# Altium project ece315.PrjPcb (part 1 of 2)
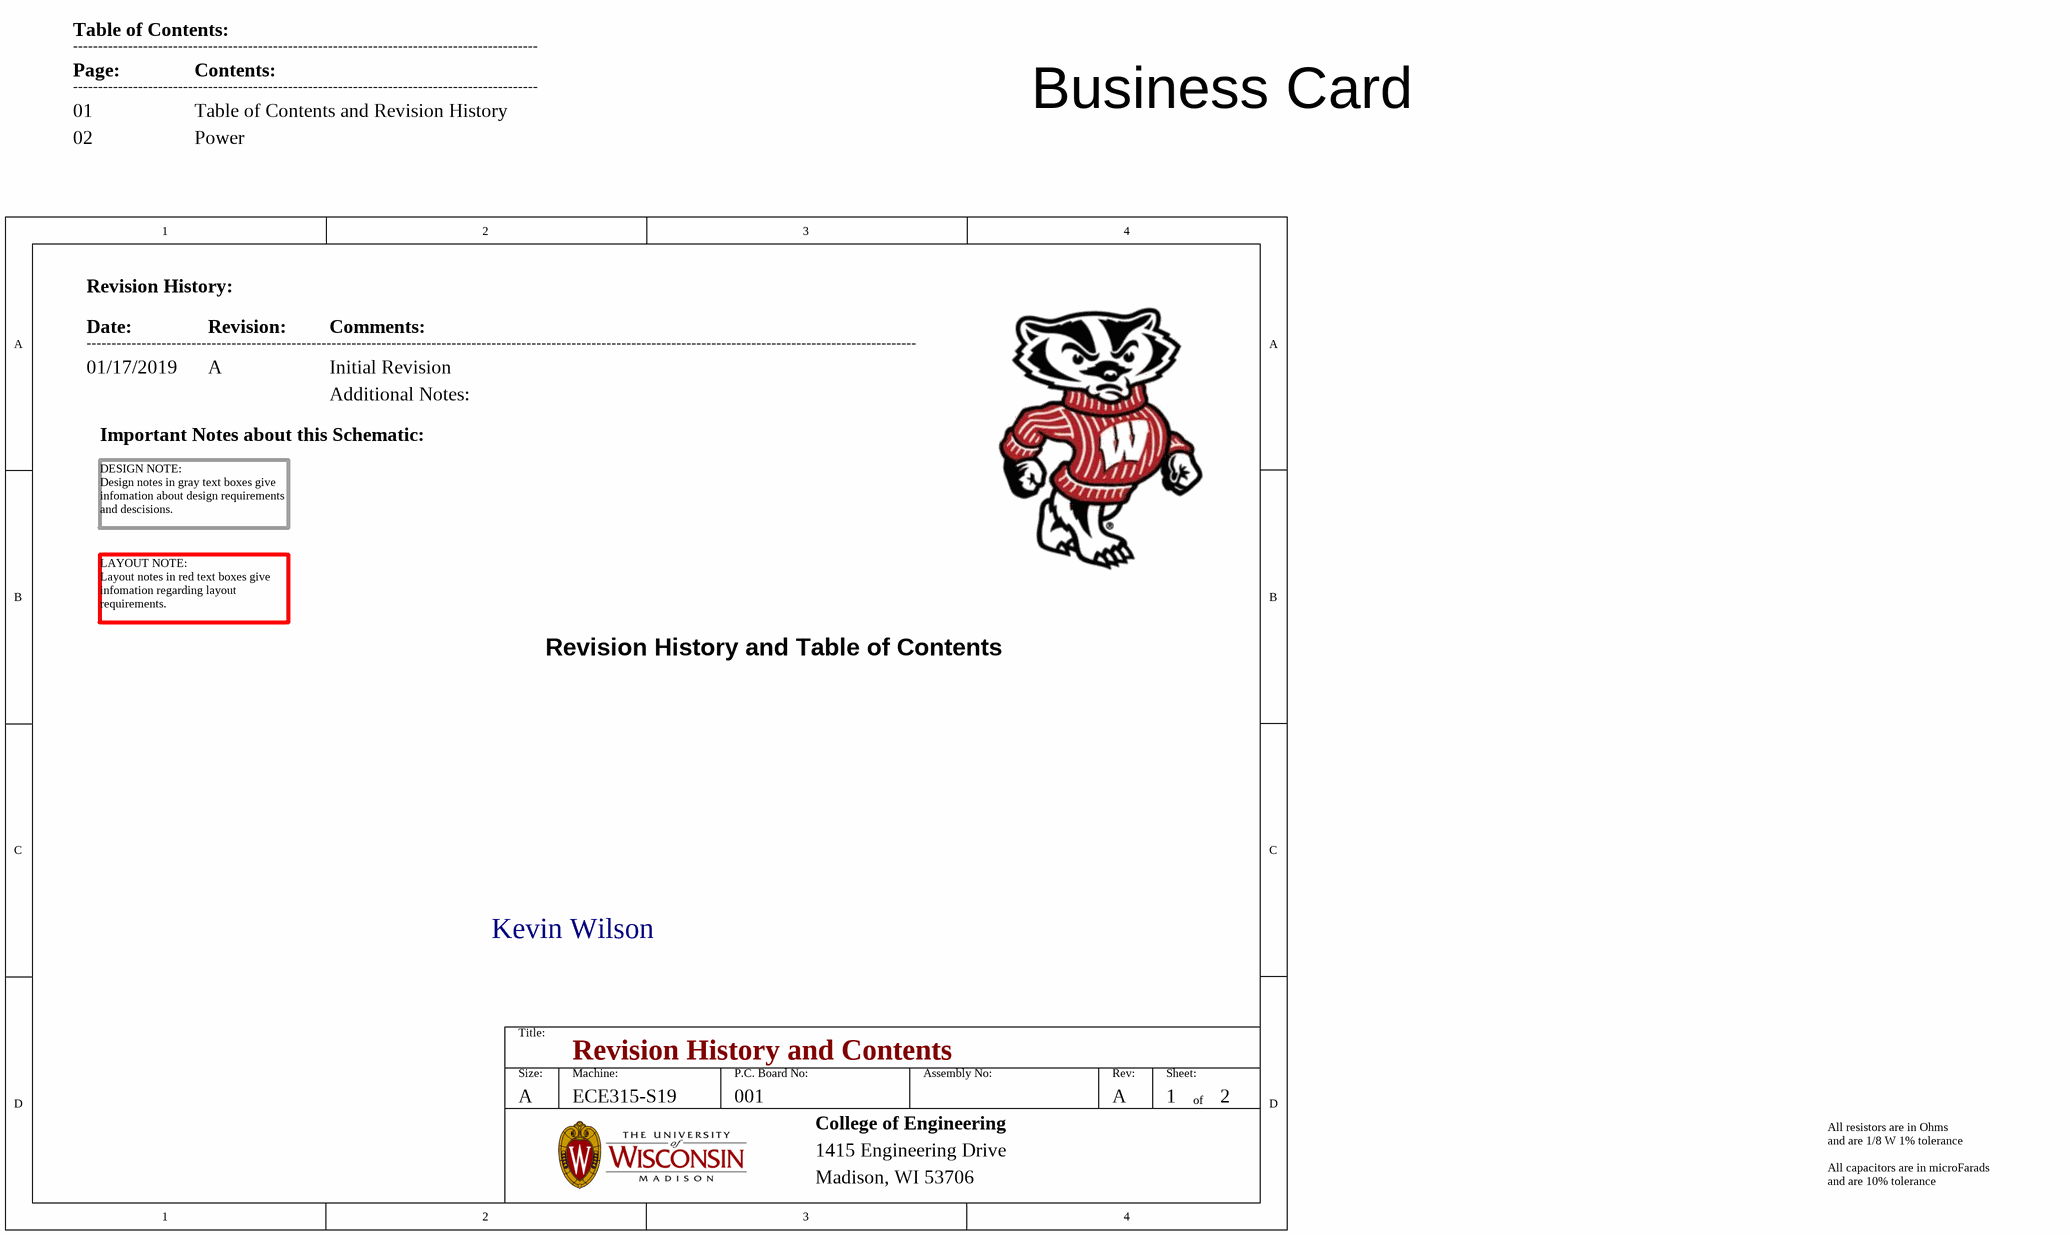
[diagram p0: 01-Revision_History_and_Contents.SchDoc]
8 sheets, 131 parts. Net scope: global (net labels, ports and power ports of the same name join across sheets).
Board file: MotionW.PcbDoc
Sheets:
  01-Revision_History_and_Contents.SchDoc
  02-Power.SchDoc
  03_MCU.SchDoc
  04_LEDs.SchDoc
  05_LEDs.SchDoc
  06_LEDs.SchDoc
  07_Buzzer.SchDoc
  08_USB_To_UART.SchDoc

## Sheet 01-Revision_History_and_Contents.SchDoc: Revision History and Contents
size A; Date: 4/25/2017; ApprovedBy: JSK; CheckedBy: JSK; Author: JSK; CompanyName: University of Wisconsin; DrawnBy: JSK; Engineer: JSK; Organization: ECE 315; Address1: College of Engineering; Address2: 1415 Engineering Drive; Address3: Madison, WI 53706; Address4: ECE 453 Spring 2017; Revision: A; SheetNumber: 1; SheetTotal: 2; MachineName: ECE315-S19; PCBNumber: 001

### Parts
PCB1  PMOD F14 REV A  (value not drawn)  (mechanical)

### Notes on the sheet
- Table of Contents:
- Page:
- ---------------------------------------------------------------------------------------------
- Contents:
- 01
- 02
- Table of Contents and Revision History
- Power
- Business Card
- Revision History:
- Date:
- 01/17/2019
- ----------------------------------------------------------------------------------------------------------------------------------------------------------------------
- Revision:
- A
- Comments:
- Initial Revision
- Important Notes about this Schematic:
- Additional Notes:
- DESIGN NOTE:
  Design notes in gray text boxes give infomation about design requirements and descisions.
- LAYOUT NOTE:
  Layout notes in red text boxes give infomation regarding layout requirements.
- Revision History and Table of Contents
- Kevin Wilson
- All resistors are in Ohms
- and are 1/8 W 1% tolerance
- All capacitors are in microFarads
- and are 10% tolerance
- Title:
- Size:
- Machine:
- P.C. Board No:
- Assembly No:
- Rev:
- Sheet:
- of
- College of Engineering
- 1415 Engineering Drive
- Madison, WI 53706

### Library data of the parts
PCB1 = PMOD F14 Rev A Bare PCB: ECE 453 Digital Themometer PMOD F14 Rev A Bare PCB; Manufacturer 1: TBD; Supplier 1: TBD; Supplier Part Number 1: N/A; Manufacturer Part Number 1: PMOD F14 REV A; Supplier Unit Price 1: 33; Package: N/A; Tolerance: N/A; Rating: N/A

## Sheet 02-Power.SchDoc: ECE315 Analog
size A; Date: 4/25/2017; ApprovedBy: JSK; CheckedBy: JSK; Author: JSK; CompanyName: University of Wisconsin; DrawnBy: JSK; Engineer: JSK; Organization: ECE 315; Address1: College of Engineering; Address2: 1415 Engineering Drive; Address3: Madison, WI 53706; Address4: ECE 315 Fall 2017; Revision: A; SheetNumber: 2; SheetTotal: 2; AssemblyNumber: 0; MachineName: ECE315-S19; PCBNumber: 001; ApprovedDate: 1/17/2019
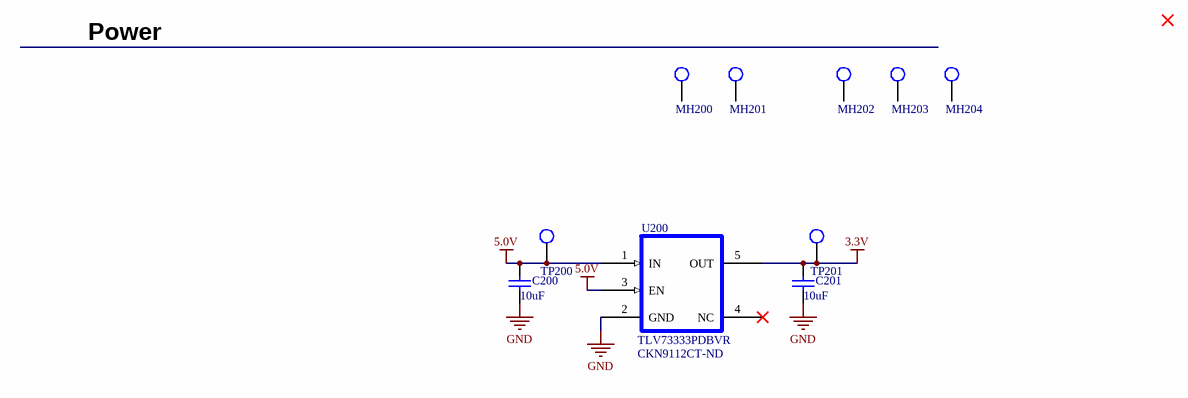
[diagram p1: 02-Power.SchDoc]

### Parts
C200  10uF  [CAP_0805]
C201  10uF  [CAP_0805]
MH200  MHOLE_2_55MM  [MHOLE_2_55MM]  (value not drawn)
MH201  MHOLE_2_55MM  [MHOLE_2_55MM]  (value not drawn)
MH202  MHOLE_2_55MM  [MHOLE_2_55MM]  (value not drawn)
MH203  MHOLE_2_55MM  [MHOLE_2_55MM]  (value not drawn)
MH204  MHOLE_2_55MM  [MHOLE_2_55MM]  (value not drawn)
TP200  TP_1206  [TP-SMC-1206]  (value not drawn)
TP201  TP_1206  [TP-SMC-1206]  (value not drawn)
U200  TLV73333PDBVR  Supplier Part Number 1: CKN9112CT-ND  [IC_TLV73333PDBVR]

### Nets
3.3V: C201.1 TP201.1 U200.5(OUT)
5.0V: C200.1 TP200.1 U200.1(IN) U200.3(EN)
GND: C200.2 C201.2 U200.2(GND)

Not connected (* = marked no-connect by the designer): MH200 1; MH201 1; MH202 1; MH203 1; MH204 1; U200 4(NC)*

### Notes on the sheet
- Power
- Title:
- Size:
- A
- Machine:
- P.C. Board No:
- Assembly No:
- Rev:
- Sheet:
- of
- College of Engineering
- 1415 Engineering Drive
- Madison, WI 53706

### Library data of the parts
C200 C201 = CAP_0805_U_010.00: CAP CER 10UF 16V X5R 0805; Manufacturer: Samsung; Manufacturer Part Number: CL21A106KOFNNNE; Tolerance: 10%; ComponentLink3URL: https://datasheet.ciiva.com/26920/getdatasheetpartid-355170-26920201.pdf; ComponentLink3Description: https://datasheet.ciiva.com/26920/getdatasheetpartid-355170-26920201.pdf; ComponentLink1URL: https://datasheet.ciiva.com/25730/cl21a106kpclqnc-25730594.pdf; ComponentLink1Description: https://datasheet.ciiva.com/25730/cl21a106kpclqnc-25730594.pdf; Mount: Surface Mount; Case/Package: 0805; Case Code (Metric): 2012; Case Code (Imperial): 0805; Min Operating Temperature: -55°C; Max Operating Temperature: 85°C; Packaging: Tape and Reel; Capacitance: 10uF; Voltage Rating: 16V; Package Quantity: 2000; Dielectric: X5R; Length: 2mm; Height: 1.25mm; Width: 0.049inch; Thickness: 0.053inch; Depth: 1.25mm; Radiation Hardening: No; ComponentLink2URL: http://www.samsungsem.com/kr/support/product-search/mlcc/CL21A106KOFNNNE.jsp; ComponentLink2Description: http://www.samsungsem.com/kr/support/product-search/mlcc/CL21A106KOFNNNE.jsp; ComponentLink4URL: http://www1.futureelectronics.com/doc/SAMSUNG/CL21A106KOFNNNE.pdf; ComponentLink4Description: http://www1.futureelectronics.com/doc/SAMSUNG/CL21A106KOFNNNE.pdf; ComponentLink5URL: https://www.verical.com/server-webapp/html/getDatasheet?partID=354009; ComponentLink5Description: https://www.verical.com/server-webapp/html/getDatasheet?partID=354009; Supplier 1: Digi-Key; Stock 1: 1158169; Pricing 1: 1=0.29, 10=0.199, 100=0.1009, 500=0.06904, 1000=0.06107 (USD)
MH200-MH204 = MHOLE_2_55MM: Mounting Holde; Manufacturer Part Number: UW MTHOLE
TP200 TP201 = TP_1206: Test Point SMD 1206; Manufacturer: TE Connectivity (Tyco Electronics); Manufacturer Part Number: 1625854-1; Resistance Value: 0 Ohm; Temperature Coefficient: N/R; Supplier 1: Digi-Key; Supplier Part Number 1: A106143CT-ND; Stock 1: 31937; Pricing 1: 1=0.28, 10=0.261, 25=0.224, 50=0.1902, 100=0.1828, 250=0.1641, 500=0.1567, 1000=0.1306 (USD); Case Size: 1206; Dimension: 3.2 x 1.6 x 1.25mm; Family: RC; Mounting: Surface Mount; Operating Temperature: -55 to 125 C; Part No: 1625854-1; RoHS: Yes; Packaging: Tape and Reel; Termination Style: N/R; Terminal Pitch: N/R; Power Rating: N/R; Tolerance: N/R; ComponentLink1URL: https://datasheet.ciiva.com/6439/eng-ds-1773266-a-6439169.pdf; ComponentLink1Description: https://datasheet.ciiva.com/6439/eng-ds-1773266-a-6439169.pdf; ComponentLink2URL: https://datasheet.ciiva.com/30136/1773266-a-30136341.pdf; ComponentLink2Description: https://datasheet.ciiva.com/30136/1773266-a-30136341.pdf; ComponentLink3URL: https://datasheet.ciiva.com/6439/eng-ds-1773266-a-6439080.pdf; ComponentLink3Description: https://datasheet.ciiva.com/6439/eng-ds-1773266-a-6439080.pdf; ComponentLink4URL: https://datasheet.ciiva.com/6439/eng-ds-1773266-a-6439081.pdf; ComponentLink4Description: https://datasheet.ciiva.com/6439/eng-ds-1773266-a-6439081.pdf; ComponentLink5URL: https://datasheet.ciiva.com/6439/eng-ds-1773266-a-6439083.pdf; ComponentLink5Description: https://datasheet.ciiva.com/6439/eng-ds-1773266-a-6439083.pdf
U200 = TLV73333PDBVR: Manufacturer: Texas Instruments; Number of Outputs: 1; Min Input Voltage: 1.4V; Max Input Voltage: 5.5V; Max Output Current: 300mA; Output Voltage: 3.3V; Dropout Voltage: 125mV; Min Current Limit: 360mA; Polarity: Positive; Quiescent Current: 60uA; Accuracy: 1%; Output Type: Fixed; Mechanical Life: 100000Cycles; Actuator Material: Nylon,Polyamide; Throw Configuration: SPST; Operating Force: 160gf; Illumination Type: Illuminated,Non-Illuminated; Switch Function: Off-Mom; Voltage Rating (DC): 12V; Actuator Type: Standard; Current Rating: 50mA; Contact Resistance: 100mR; Actuator Length: 0.85mm; Manufacturer Part Number: TLV73333PDBVR; Mount: Surface Mount; Case/Package: SOT-23-5; Number of Pins: 5; Weight: 0.000557oz; Contact Plating: Gold; Min Operating Temperature: -40°C; Max Operating Temperature: 125°C; Packaging: Tape and Reel; Output Current: 300mA; Number of Regulators: 1; Package Quantity: 3000; Radiation Hardening: No; Lead Free: Lead Free; ComponentLink1URL: http://www.ti.com/general/docs/lit/getliterature.tsp?genericPartNumber=TLV733P&&fileType=pdf; ComponentLink1Description: http://www.ti.com/general/docs/lit/getliterature.tsp?genericPartNumber=TLV733P&&fileType=pdf; Supplier 1: Digi-Key; Stock 1: 783192; Pricing 1: 1=0.16, 10=0.157, 25=0.1516, 50=0.1462, 100=0.1381, 250=0.12996, 500=0.12452 (USD); Contact Material: Silver; Color: Black; Termination: Gull Wing; Max Voltage Rating (DC): 12V; Orientation: Straight; Max Current Rating: 50mA; Length: 6mm; Depth: 9mm; REACH SVHC: No SVHC; ComponentLink2URL: https://www.verical.com/server-webapp/html/getDatasheet?partID=786341; ComponentLink2Description: https://www.verical.com/server-webapp/html/getDatasheet?partID=786341; ComponentLink3URL: https://www.ckswitches.com/media/1471/pts645.pdf; ComponentLink3Description: https://www.ckswitches.com/media/1471/pts645.pdf; ComponentLink4URL: https://www.verical.com/server-webapp/html/getDatasheet?partID=764615; ComponentLink4Description: https://www.verical.com/server-webapp/html/getDatasheet?partID=764615

## Sheet 03_MCU.SchDoc: ECE315 MCU
size A; Date: 4/25/2017; ApprovedBy: JSK; CheckedBy: JSK; Author: JSK; CompanyName: University of Wisconsin; DrawnBy: JSK; Engineer: JSK; Organization: ECE 315; Address1: College of Engineering; Address2: 1415 Engineering Drive; Address3: Madison, WI 53706; Address4: ECE 315 Fall 2017; Revision: A; SheetNumber: 3; SheetTotal: 6; AssemblyNumber: 0; MachineName: ECE315-S19; PCBNumber: 001; ApprovedDate: 1/17/2019
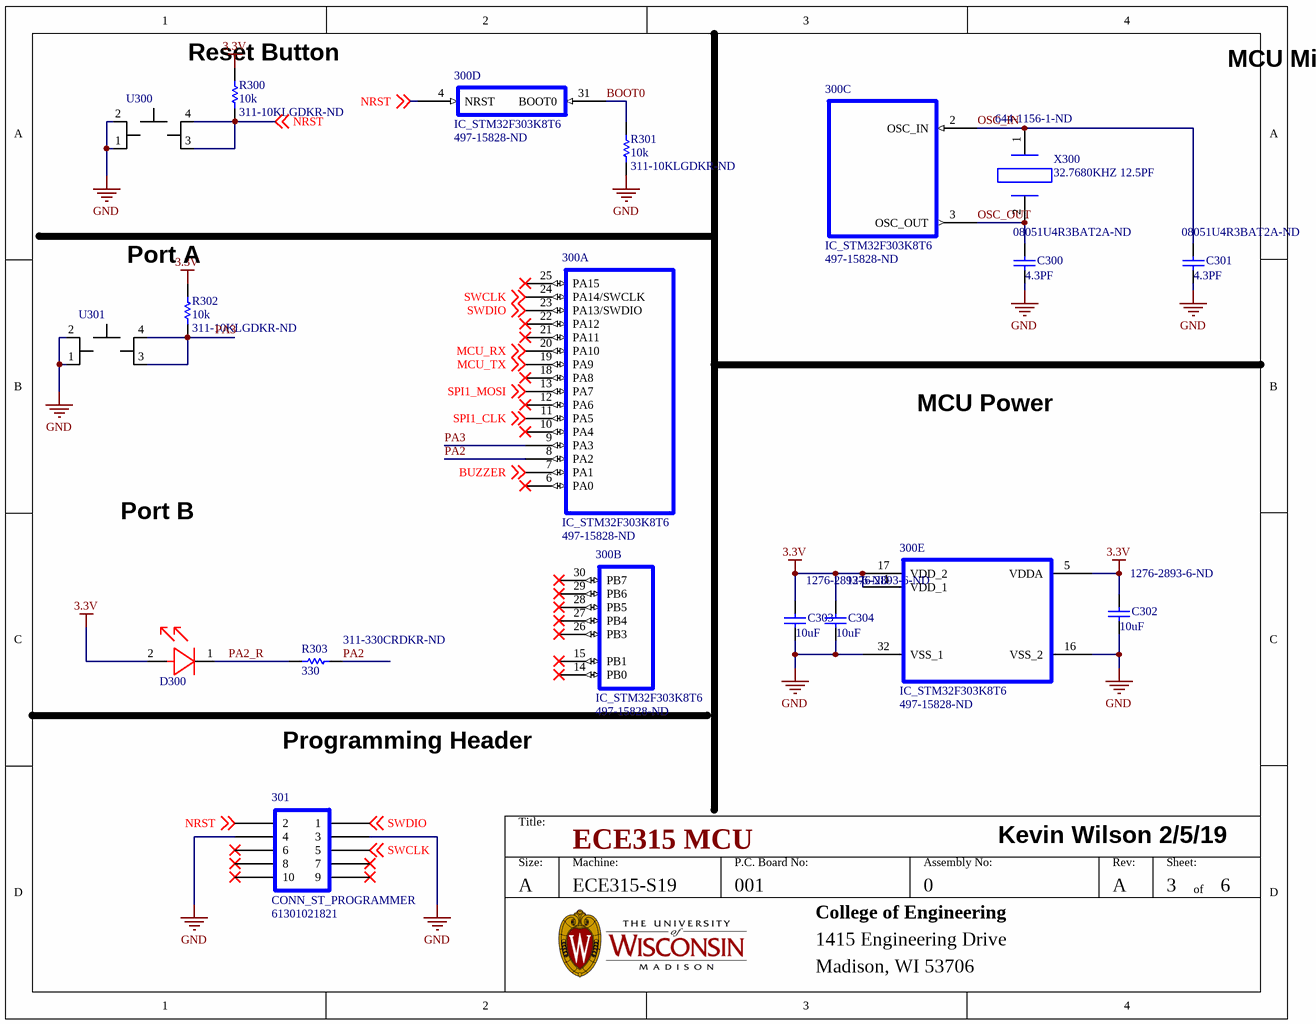
[diagram p2: 03_MCU.SchDoc]

### Parts
300  IC_STM32F303K8T6  Supplier Part Number 1: 497-15828-ND  [IC_STM32FM]  (parts A,B,C,D,E of 5)
301  CONN_ST_PROGRAMMER  Manufacturer Part Number: 61301021821  [CONN_ST_PROGRAMMER]
C300  4.3PF  Supplier Part Number 1: 08051U4R3BAT2A-ND  [CAP_0805]
C301  4.3PF  Supplier Part Number 1: 08051U4R3BAT2A-ND  [CAP_0805]
C302  10uF  Supplier Part Number 1: 1276-2893-6-ND  [CAP_0805]
C303  10uF  Supplier Part Number 1: 1276-2893-6-ND  [CAP_0805]
C304  10uF  Supplier Part Number 1: 1276-2893-6-ND  [CAP_0805]
D300  LED_RED_0805.1  [LED_RED_0805]  (value not drawn)
R300  Supplier Part Number 1: 311-10KLGDKR-ND  [RES_0805]  (hidden comment: 10K)
R301  Supplier Part Number 1: 311-10KLGDKR-ND  [RES_0805]  (hidden comment: 10K)
R302  Supplier Part Number 1: 311-10KLGDKR-ND  [RES_0805]  (hidden comment: 10K)
R303  Supplier Part Number 1: 311-330CRDKR-ND  [RES_0805]  (hidden comment: 330)
U300  SWITCH_6mm_6mm_smd  [SW_6mm_6mm_SMT]  (value not drawn)
U301  SWITCH_6mm_6mm_smd  [SW_6mm_6mm_SMT]  (value not drawn)
X300  32.7680KHZ 12.5PF  Supplier Part Number 2: 644-1156-1-ND  [NX3215SA-32.768K-STD-MUA-8]

### Nets
3.3V: 300.1(VDD_1) 300.5(VDDA) 300.17(VDD_2) C302.1 C303.1 C304.1 D300.2(Anode) R300.2 R302.2
GND: 300.16(VSS_2) 300.32(VSS_1) 301.?2(3) 301.?9(4) C300.1 C301.1 C302.2 C303.2 C304.2 R301.1 U300.1 U300.2 U301.1 U301.2
BOOT0: 300.31(BOOT0) R301.2
BUZZER: 300.7(PA1) ; off-sheet BUZZER
MCU_RX: 300.20(PA10) ; off-sheet MCU_RX
MCU_TX: 300.19(PA9) ; off-sheet MCU_TX
NRST: 300.4(NRST) 301.?10(2) R300.1 U300.3 U300.4(VCCIO) ; off-sheet NRST
OSC_IN: 300.2(OSC_IN) C301.2 X300.1
OSC_OUT: 300.3(OSC_OUT) C300.2 X300.2
PA2: 300.8(PA2) R303.1
PA2_R: D300.1(Cathode) R303.2
PA3: 300.9(PA3) R302.1 U301.3 U301.4(VCCIO)
SPI1_CLK: 300.11(PA5) ; off-sheet SPI1_CLK
SPI1_MOSI: 300.13(PA7) ; off-sheet SPI1_MOSI
SWCLK: 300.24(PA14/SWCLK) 301.?3(5) ; off-sheet SWCLK
SWDIO: 300.23(PA13/SWDIO) 301.?1(1) ; off-sheet SWDIO

Not connected (* = marked no-connect by the designer): 300 6(PA0)* 10(PA4)* 12(PA6)* 14(PB0)* 15(PB1)* 18(PA8)* 21(PA11)* 22(PA12)* 25(PA15)* 26(PB3)* 27(PB4)* 28(PB5)* 29(PB6)* 30(PB7)*; 301 ?4(7)* ?5(9)* ?6(10)* ?7(8)* ?8(6)*

### Notes on the sheet
- Reset Button
- MCU Misc
- Port A
- MCU Power
- Port B
- Programming Header
- Kevin Wilson 2/5/19
- Title:
- Size:
- A
- Machine:
- P.C. Board No:
- Assembly No:
- Rev:
- Sheet:
- of
- College of Engineering
- 1415 Engineering Drive
- Madison, WI 53706

### Library data of the parts
301 = CONN_ST_PROGRAMMER: Manufacturer: Wurth Electronics; Current Rating: 3A; Voltage Rating: 250V; Number of Positions: 10; Insulation Resistance: 1GR; Gender: Receptacle; Connector Type: Header,Socket; Pitch: 2.54mm; Row Spacing: 0.1inch; Supplier 1: Digi-Key; Stock 1: 1798; Pricing 1: 1=0.74, 10=0.728, 50=0.672, 100=0.616, 320=0.56 (USD); Mount: Through Hole; Contact Plating: Gold; Housing Material: PBT; Contact Material: Copper,Copper Alloy; Color: Black; Min Operating Temperature: -40°C; Max Operating Temperature: 125°C; Number of Rows: 2; Contact Gender: Female; Packaging: Tray; Package Quantity: 320; Termination: Solder; Number of Contacts: 10; Length: 5.08mm; Height: 12.5mm; Width: 13.2mm; REACH SVHC: Unknown; Flammability Rating: UL94 V-0; ComponentLink1URL: http://www.mouser.com/ds/2/445/6130xx21821-537816.pdf; ComponentLink1Description: http://www.mouser.com/ds/2/445/6130xx21821-537816.pdf; ComponentLink2URL: https://katalog.we-online.de/em/datasheet/6130xx21821.pdf; ComponentLink2Description: https://katalog.we-online.de/em/datasheet/6130xx21821.pdf; ComponentLink3URL: http://www.farnell.com/datasheets/1442176.pdf; ComponentLink3Description: http://www.farnell.com/datasheets/1442176.pdf; Supplier Part Number 1: 732-2861-ND
C300 C301 = CAP_0805_P_004.30: CAP CER 4.3PF 100V NP0 0805; Manufacturer: Kyocera AVX; Manufacturer Part Number: 08051U4R3BAT2A; Dielectric: C0G; ComponentLink1URL: https://datasheet.ciiva.com/204/ccog-204944.pdf; ComponentLink1Description: https://datasheet.ciiva.com/204/ccog-204944.pdf; ComponentLink2URL: https://datasheet.ciiva.com/11570/ccog-11570969.pdf; ComponentLink2Description: https://datasheet.ciiva.com/11570/ccog-11570969.pdf; Supplier 1: Digi-Key; Stock 1: 0; Pricing 1: 4000=0.14663 (USD); Mount: Surface Mount; Case/Package: 0805; Case Code (Imperial): 0805; Case Code (Metric): 2012; Min Operating Temperature: -55°C; Max Operating Temperature: 125°C; Capacitance: 4.3pF; Package Quantity: 4000; Voltage Rating: 100V; Voltage Rating (DC): 100V; Packaging: Tape and Reel; Termination: SMD/SMT; Composition: Ceramic; Length: 2.01mm; Height: 1.02mm; Width: 1.25mm; Thickness: 0.045inch; Depth: 1.25mm; Radiation Hardening: No; ComponentLink3URL: http://datasheets.avx.com/U-Series.pdf; ComponentLink3Description: http://datasheets.avx.com/U-Series.pdf; ComponentLink4URL: http://www.avxcorp.com/docs/Catalogs/useries.pdf; ComponentLink4Description: http://www.avxcorp.com/docs/Catalogs/useries.pdf
C302-C304 = CAP_0805_U_010.00: as C200 on sheet 02-Power; ComponentLink3URL: https://datasheet.ciiva.com/26920/getdatasheetpartid-355170-26920201.pdf; ComponentLink3Description: https://datasheet.ciiva.com/26920/getdatasheetpartid-355170-26920201.pdf; ComponentLink1URL: https://datasheet.ciiva.com/25730/cl21a106kpclqnc-25730594.pdf; ComponentLink1Description: https://datasheet.ciiva.com/25730/cl21a106kpclqnc-25730594.pdf; Mount: Surface Mount; Case/Package: 0805; Case Code (Metric): 2012; Case Code (Imperial): 0805; Min Operating Temperature: -55°C; Max Operating Temperature: 85°C; Packaging: Tape and Reel; Capacitance: 10uF; Voltage Rating: 16V; Package Quantity: 2000; Dielectric: X5R; Length: 2mm; Height: 1.25mm; Width: 0.049inch; Thickness: 0.053inch; Depth: 1.25mm; Radiation Hardening: No; ComponentLink2URL: http://www.samsungsem.com/kr/support/product-search/mlcc/CL21A106KOFNNNE.jsp; ComponentLink2Description: http://www.samsungsem.com/kr/support/product-search/mlcc/CL21A106KOFNNNE.jsp; ComponentLink4URL: http://www1.futureelectronics.com/doc/SAMSUNG/CL21A106KOFNNNE.pdf; ComponentLink4Description: http://www1.futureelectronics.com/doc/SAMSUNG/CL21A106KOFNNNE.pdf; ComponentLink5URL: https://www.verical.com/server-webapp/html/getDatasheet?partID=354009; ComponentLink5Description: https://www.verical.com/server-webapp/html/getDatasheet?partID=354009; Supplier 1: Digi-Key; Stock 1: 1158169; Pricing 1: 1=0.29, 10=0.199, 100=0.1009, 500=0.06904, 1000=0.06107 (USD)
D300 = LED_RED_0805.1: LED SUPER RED CLR THIN 0805 SMD; Manufacturer: Vishay / Lite-On; Manufacturer Part Number: LTST-C171KRKT; Chip Material: AlGaInP; DELETED: Compliant; Dominant Wave Length: 631 nm; Forward Current: 30 mA; Forward Voltage: 2.4 V; High Brightness: Yes; Lum Intensity: 54mcd; Main Category: Chip LED; Number of  Elements: 1; Peak Wavelength: 639 nm; Power Dissipation: 75 W; Product Depth (mm): 1.25 mm; Product Height (mm): 0.8 mm; Product Length (mm): 2 mm; Rad Hardened: No; Reverse Voltage: 5 V; Shape Type: Rectangular; Test Current (It): 20 mA; Type: Uni-Color; Viewing Angle: 130 deg; Supplier 1: Digi-Key; Emitting Color: Red; Lens Dimensions: 1.4x1.25x0.5 mm; Luminous Intensity: 54mcd; Mounting: Surface Mount; Operating Temp Range: -55C to 85C; Operating Temperature Classification: Industrial; Package Type: Chip Led; Packaging: Tape and Reel; Pin Count: 2; ComponentLink1URL: https://datasheet.ciiva.com/2110/s-110-ltst-c171krkt-2110066.pdf; ComponentLink1Description: https://datasheet.ciiva.com/2110/s-110-ltst-c171krkt-2110066.pdf; ComponentLink2URL: https://datasheet.ciiva.com/2110/s-110-ltst-c171krkt-2110067.pdf; ComponentLink2Description: https://datasheet.ciiva.com/2110/s-110-ltst-c171krkt-2110067.pdf; ComponentLink3URL: https://datasheet.ciiva.com/2110/s-110-ltst-c171krkt-2110068.pdf; ComponentLink3Description: https://datasheet.ciiva.com/2110/s-110-ltst-c171krkt-2110068.pdf; ComponentLink4URL: https://datasheet.ciiva.com/12403/lite-on-ltst-c171krkt-187201-12403781.pdf; ComponentLink4Description: https://datasheet.ciiva.com/12403/lite-on-ltst-c171krkt-187201-12403781.pdf; ComponentLink5URL: https://datasheet.ciiva.com/11775/0900766b80dc0299-11775643.pdf; ComponentLink5Description: https://datasheet.ciiva.com/11775/0900766b80dc0299-11775643.pdf; ComponentLink6URL: https://datasheet.ciiva.com/16444/lite-on20ltst-c171krkt-16444779.pdf; ComponentLink6Description: https://datasheet.ciiva.com/16444/lite-on20ltst-c171krkt-16444779.pdf; Supplier Part Number 1: LTST-C171KEKTCT-ND
R300-R302 = RES_0805_K_010.00: RES SMD 10K OHM 1% 1/8W 0805; Manufacturer: Panasonic / Panasonic ECG; Manufacturer Part Number: ERJ-6ENF1002V; Power Rating: 125mW; Temperature Coefficient: ± 200ppm/°C; Voltage Rating: 150V; Resistor Element Material: Thick Film; Resistor Case Style: 0805; No. of Pins: 2; Product Range: PANASONIC - ERJ Series; Series: ERJ; Resistance Tolerance: ± 1%; Resistor Mounting: SMD; Resistor Element Type: Thick Film; ComponentLink1URL: https://datasheet.ciiva.com/11808/0900766b80f80784-11808080.pdf; ComponentLink1Description: https://datasheet.ciiva.com/11808/0900766b80f80784-11808080.pdf; ComponentLink2URL: https://datasheet.ciiva.com/16514/aoa0000ce2-16514021.pdf; ComponentLink2Description: https://datasheet.ciiva.com/16514/aoa0000ce2-16514021.pdf; ComponentLink3URL: https://datasheet.ciiva.com/27055/1988971-27055733.pdf; ComponentLink3Description: https://datasheet.ciiva.com/27055/1988971-27055733.pdf; ComponentLink4URL: https://datasheet.ciiva.com/16759/70260748-16759350.pdf; ComponentLink4Description: https://datasheet.ciiva.com/16759/70260748-16759350.pdf; ComponentLink5URL: https://datasheet.ciiva.com/16725/70260748-16725031.pdf; ComponentLink5Description: https://datasheet.ciiva.com/16725/70260748-16725031.pdf; ComponentLink6URL: https://datasheet.ciiva.com/7830/426256-7830745.pdf; ComponentLink6Description: https://datasheet.ciiva.com/7830/426256-7830745.pdf; ComponentLink7URL: https://datasheet.ciiva.com/46372/1678782-46372714.pdf; ComponentLink7Description: https://datasheet.ciiva.com/46372/1678782-46372714.pdf; ComponentLink8URL: https://datasheet.ciiva.com/46372/1678782-46372715.pdf; ComponentLink8Description: https://datasheet.ciiva.com/46372/1678782-46372715.pdf; ComponentLink9URL: https://datasheet.ciiva.com/17212/aoa0000ce2-17212108.pdf; ComponentLink9Description: https://datasheet.ciiva.com/17212/aoa0000ce2-17212108.pdf; ComponentLink10URL: https://datasheet.ciiva.com/30140/aoa0000ce2-30140236.pdf; ComponentLink10Description: https://datasheet.ciiva.com/30140/aoa0000ce2-30140236.pdf; ComponentLink11URL: https://datasheet.ciiva.com/16740/aoa0000ce2-16740669.pdf; ComponentLink11Description: https://datasheet.ciiva.com/16740/aoa0000ce2-16740669.pdf; ComponentLink12URL: https://datasheet.ciiva.com/24070/aoa0000ce2-24070702.pdf; ComponentLink12Description: https://datasheet.ciiva.com/24070/aoa0000ce2-24070702.pdf; Case/Package: 0805; Case Code (Imperial): 0805; Case Code (Metric): 2012; Min Operating Temperature: -55°C; Max Operating Temperature: 155°C; Packaging: Tape and Reel; Tolerance: 1%; Package Quantity: 1; Termination: SMD/SMT; Composition: Thick Film; Number of Terminations: 2; Military Standard: Not; Max Power Dissipation: 125mW; Features: Moisture Resistant; Length: 2mm; Height: 0.024inch; Width: 0.049inch; Depth: 1.25mm; REACH SVHC: Unknown; Lead Free: Lead Free; ComponentLink13URL: http://www.yageo.com/documents/recent/PYu-RC_Group_51_RoHS_L_9.pdf; ComponentLink13Description: http://www.yageo.com/documents/recent/PYu-RC_Group_51_RoHS_L_9.pdf; ComponentLink14URL: http://www.farnell.com/datasheets/444164.pdf; ComponentLink14Description: http://www.farnell.com/datasheets/444164.pdf; ComponentLink15URL: http://www.yageo.com/documents/recent/PYu-RC_Group_51_RoHS_L_10.pdf; ComponentLink15Description: http://www.yageo.com/documents/recent/PYu-RC_Group_51_RoHS_L_10.pdf; ComponentLink16URL: http://www.yageo.ru/pdf/RC0805.pdf; ComponentLink16Description: http://www.yageo.ru/pdf/RC0805.pdf; Supplier 1: Digi-Key; Stock 1: 802268; Pricing 1: 1=0.1, 10=0.05, 100=0.0205, 1000=0.00921, 2500=0.00799 (USD); ComponentLink17URL: http://www.yageo.com/NewPortal/yageodocoutput?fileName=/pdf/R-Chip/PYu-AC_51_RoHS_L_6.pdf; ComponentLink17Description: http://www.yageo.com/NewPortal/yageodocoutput?fileName=/pdf/R-Chip/PYu-AC_51_RoHS_L_6.pdf; Resistance: 10k
R303 = RES_0805_R_330.00: RES SMD 330 OHM 1% 1/8W 0805; Manufacturer: Panasonic / Panasonic ECG; Manufacturer Part Number: ERJ-6ENF3300V; Temperature Coefficient: ± 200ppm/°C; Voltage Rating: 150V; SVHC: To Be Advised; Product Range: PANASONIC - ERJ Series; Power Rating: 125mW; Resistor Case Style: 0805 ^2012 Metric]; Resistor Element Type: Thick Film; Packaging: Full Reel; Resistance Tolerance: ± 1%; ComponentLink1URL: https://datasheet.ciiva.com/11821/0900766b80f80784-11821635.pdf; ComponentLink1Description: https://datasheet.ciiva.com/11821/0900766b80f80784-11821635.pdf; ComponentLink2URL: https://datasheet.ciiva.com/30131/aoa0000ce2-30131349.pdf; ComponentLink2Description: https://datasheet.ciiva.com/30131/aoa0000ce2-30131349.pdf; ComponentLink3URL: https://datasheet.ciiva.com/24025/aoa0000ce2-24025991.pdf; ComponentLink3Description: https://datasheet.ciiva.com/24025/aoa0000ce2-24025991.pdf; ComponentLink4URL: https://datasheet.ciiva.com/17206/aoa0000ce2-17206152.pdf; ComponentLink4Description: https://datasheet.ciiva.com/17206/aoa0000ce2-17206152.pdf; ComponentLink5URL: https://datasheet.ciiva.com/46436/1678782-46436633.pdf; ComponentLink5Description: https://datasheet.ciiva.com/46436/1678782-46436633.pdf; ComponentLink6URL: https://datasheet.ciiva.com/46436/1678782-46436634.pdf; ComponentLink6Description: https://datasheet.ciiva.com/46436/1678782-46436634.pdf; ComponentLink7URL: https://datasheet.ciiva.com/16760/70260748-16760668.pdf; ComponentLink7Description: https://datasheet.ciiva.com/16760/70260748-16760668.pdf; ComponentLink8URL: https://datasheet.ciiva.com/16780/70260748-16780764.pdf; ComponentLink8Description: https://datasheet.ciiva.com/16780/70260748-16780764.pdf; ComponentLink9URL: https://datasheet.ciiva.com/22684/1678782-22684798.pdf; ComponentLink9Description: https://datasheet.ciiva.com/22684/1678782-22684798.pdf; ComponentLink10URL: https://datasheet.ciiva.com/28590/1678782-28590783.pdf; ComponentLink10Description: https://datasheet.ciiva.com/28590/1678782-28590783.pdf; Supplier 1: Digi-Key; Stock 1: 3197096; Pricing 1: 1=0.1, 10=0.042, 100=0.017, 1000=0.00762, 2500=0.00662 (USD); Case/Package: 0805; Case Code (Imperial): 0805; Case Code (Metric): 2012; Min Operating Temperature: -55°C; Max Operating Temperature: 155°C; Tolerance: 1%; Composition: Thick Film; Package Quantity: 1; Number of Terminations: 2; Military Standard: Not; Termination: SMD/SMT; Max Power Dissipation: 125mW; Features: Moisture Resistant; Length: 2mm; Height: 0.024inch; Width: 0.049inch; Depth: 1.25mm; REACH SVHC: Unknown; Lead Free: Lead Free; ComponentLink11URL: http://www.yageo.ru/pdf/RC0805.pdf; ComponentLink11Description: http://www.yageo.ru/pdf/RC0805.pdf; ComponentLink12URL: http://www.yageo.com/documents/recent/PYu-RC_Group_51_RoHS_L_9.pdf; ComponentLink12Description: http://www.yageo.com/documents/recent/PYu-RC_Group_51_RoHS_L_9.pdf; ComponentLink13URL: http://www.yageo.com/documents/recent/PYu-RC_Group_51_RoHS_L_10.pdf; ComponentLink13Description: http://www.yageo.com/documents/recent/PYu-RC_Group_51_RoHS_L_10.pdf; ComponentLink14URL: http://www.yageo.com.tw/exep/pages/download/literatures/PYu-R_INT-thick_7.pdf; ComponentLink14Description: http://www.yageo.com.tw/exep/pages/download/literatures/PYu-R_INT-thick_7.pdf; ComponentLink15URL: http://www.farnell.com/datasheets/444164.pdf; ComponentLink15Description: http://www.farnell.com/datasheets/444164.pdf; Resistance: 330
U300 U301 = SWITCH_6mm_6mm_smd: SWITCH TACTILE SPST-NO 0.05A 12V; Manufacturer: C&K Components; Manufacturer Part Number: PTS645SH50SMTR92 LFS; Operating Force: 200gf; Illumination: Non-Illuminated; Switch Function: Off-Mom; Actuator Height off PCB, from Pins: 5.00mm; Actuator Type: Standard; Actuator Material: Polyamide (PA66), Nylon 6/6; Contact Rating @ Voltage: 0.05A @ 12VDC; Actuator Orientation: Top Actuated; Outline: 6.00mm x 6.00mm; Mechanical Life: 100,000 Cycles; Throw Configuration: SPST; Current Rating: 50mA; Illumination Type, Color: -; Packaging: Tape & Reel (TR); Illumination Voltage (Nominal): -; Ingress Protection: -; Switch Travel: -; Category: Switches; Circuit: SPST-NO; Supplier: Digi-Key; Termination Style: Gull Wing; Features: -; Mounting Type: Surface Mount; Operating Temperature: -20°C ~ 60°C; RoHS: RoHS Compliant; Supplier Part Number: CKN9085TR-ND; Supplier 1: Mouser; Supplier Part Number 1: 611-PTS530GG065SMTR; Mount: Surface Mount; Contact Plating: Silver; Min Operating Temperature: -40°C; Max Operating Temperature: 85°C; Package Quantity: 7000; Termination: Gull Wing; Illumination Type: Non-Illuminated; Voltage Rating (DC): 12V; ComponentLink1URL: http://www.mouser.com/ds/2/60/pts530_4mar13-305907.pdf; ComponentLink1Description: http://www.mouser.com/ds/2/60/pts530_4mar13-305907.pdf; ComponentLink2URL: http://www.ck-components.com/80182/pts530_4mar13.pdf/; ComponentLink2Description: http://www.ck-components.com/80182/pts530_4mar13.pdf/; Stock 1: 36566; Pricing 1: 1=0.24, 10=0.229, 50=0.213, 100=0.202, 1000=0.138, 10000=0.104 (USD)
X300 = CRYSTAL_NX3215SA-32.768K: CRYSTAL 32.768KHZ 12.5PF SMD; Manufacturer: Nihon Dempa Kogyo (NDK); Catalog Drawings: NX3215SA Series Top / NX3215SA Series Side / NX3215SA Series Bottom / NX3215SA Series Circuit; Featured Product: NX3215SA Series 32.768KHz SMD Crystals; Frequency Tolerance: ±20ppm; ESR (Equivalent Series Resistance): 70 kOhm; Operating Mode: Fundamental; Dynamic Catalog: NX3215SA Series; Other Names: 644-1156-6; Supplier 1: Digikey; Stock 1: 45314; Pricing 1: 1=0.94, 10=0.835, 50=0.7804, 100=0.6897, 500=0.6534, 1000=0.5445 (USD); Standard Package: 1; Category: Crystals and Oscillators; Family: Crystals; Series: NX3215SA; Type: kHz Crystal (Tuning Fork); Frequency: 32.768kHz; Load Capacitance: 12.5pF; Operating Temperature: -40°C ~ 85°C; Mounting Type: Surface Mount; Package / Case: 2-SMD; Size / Dimension: 0.126" L x 0.059" W (3.20mm x 1.50mm); Height: 0.035" (0.90mm); Packaging: Digi-Reel®; ComponentLink1URL: https://datasheet.ciiva.com/857/c-nx3215sa-std-mua-9-e-857050.pdf; ComponentLink1Description: https://datasheet.ciiva.com/857/c-nx3215sa-std-mua-9-e-857050.pdf; ComponentLink2URL: https://datasheet.ciiva.com/857/c-nx3215sa-std-mua-9-e-857051.pdf; ComponentLink2Description: https://datasheet.ciiva.com/857/c-nx3215sa-std-mua-9-e-857051.pdf; ComponentLink3URL: https://datasheet.ciiva.com/857/c-nx3215sa-std-mua-9-e-857052.pdf; ComponentLink3Description: https://datasheet.ciiva.com/857/c-nx3215sa-std-mua-9-e-857052.pdf; Supplier Part Number 1: 644-1156-1-ND; Manufacturer Part Number: NX3215SA-32.768K-STD-MUA-8; Supplier 2: Digi-Key
300 = IC_STM32F303K8T6: Supplier 1: Digi-Key

## Sheet 04_LEDs.SchDoc: ECE315 Analog
size A; Date: 4/25/2017; ApprovedBy: JSK; CheckedBy: JSK; Author: JSK; CompanyName: University of Wisconsin; DrawnBy: JSK; Engineer: JSK; Organization: ECE 315; Address1: College of Engineering; Address2: 1415 Engineering Drive; Address3: Madison, WI 53706; Address4: ECE 315 Fall 2017; Revision: A; SheetNumber: 2; SheetTotal: 2; AssemblyNumber: 0; MachineName: ECE315-S19; PCBNumber: 001; ApprovedDate: 1/17/2019
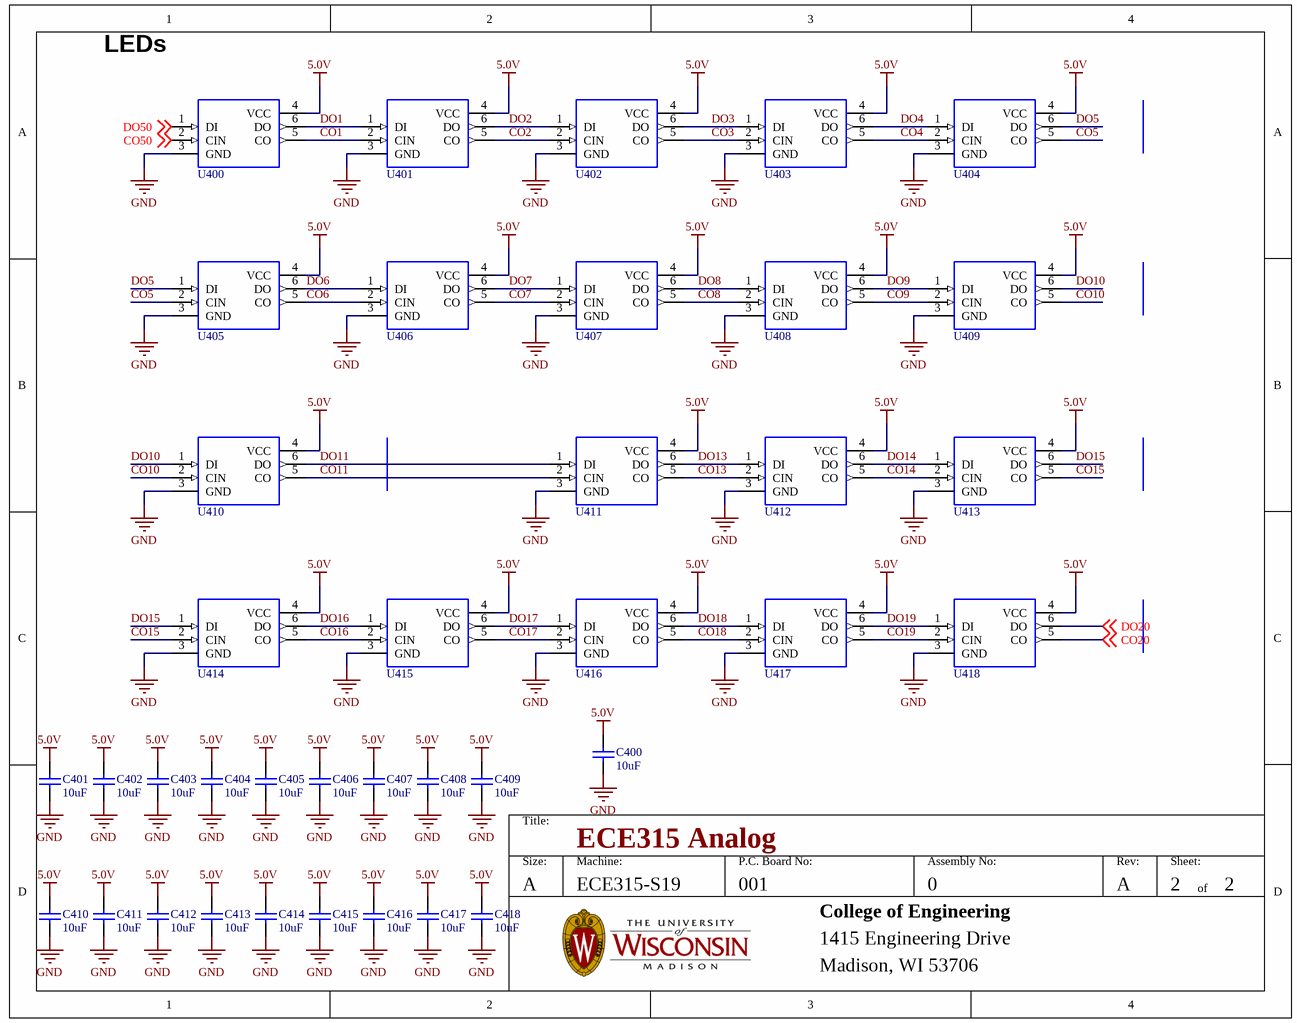
[diagram p3: 04_LEDs.SchDoc]

### Parts
C400  10uF  [CAP_0805]
C401  10uF  [CAP_0805]
C402  10uF  [CAP_0805]
C403  10uF  [CAP_0805]
C404  10uF  [CAP_0805]
C405  10uF  [CAP_0805]
C406  10uF  [CAP_0805]
C407  10uF  [CAP_0805]
C408  10uF  [CAP_0805]
C409  10uF  [CAP_0805]
C410  10uF  [CAP_0805]
C411  10uF  [CAP_0805]
C412  10uF  [CAP_0805]
C413  10uF  [CAP_0805]
C414  10uF  [CAP_0805]
C415  10uF  [CAP_0805]
C416  10uF  [CAP_0805]
C417  10uF  [CAP_0805]
C418  10uF  [CAP_0805]
U400  IC_APA102C  [APA102C]  (value not drawn)
U401  IC_APA102C  [APA102C]  (value not drawn)
U402  IC_APA102C  [APA102C]  (value not drawn)
U403  IC_APA102C  [APA102C]  (value not drawn)
U404  IC_APA102C  [APA102C]  (value not drawn)
U405  IC_APA102C  [APA102C]  (value not drawn)
U406  IC_APA102C  [APA102C]  (value not drawn)
U407  IC_APA102C  [APA102C]  (value not drawn)
U408  IC_APA102C  [APA102C]  (value not drawn)
U409  IC_APA102C  [APA102C]  (value not drawn)
U410  IC_APA102C  [APA102C]  (value not drawn)
U411  IC_APA102C  [APA102C]  (value not drawn)
U412  IC_APA102C  [APA102C]  (value not drawn)
U413  IC_APA102C  [APA102C]  (value not drawn)
U414  IC_APA102C  [APA102C]  (value not drawn)
U415  IC_APA102C  [APA102C]  (value not drawn)
U416  IC_APA102C  [APA102C]  (value not drawn)
U417  IC_APA102C  [APA102C]  (value not drawn)
U418  IC_APA102C  [APA102C]  (value not drawn)

### Nets
5.0V: C400.2 C401.2 C402.2 C403.2 C404.2 C405.2 C406.2 C407.2 C408.2 C409.2 C410.2 C411.2 C412.2 C413.2 C414.2 C415.2 C416.2 C417.2 C418.2 U400.4(VCC) U401.4(VCC) U402.4(VCC) U403.4(VCC) U404.4(VCC) U405.4(VCC) U406.4(VCC) U407.4(VCC) U408.4(VCC) U409.4(VCC) U410.4(VCC) U411.4(VCC) U412.4(VCC) U413.4(VCC) U414.4(VCC) U415.4(VCC) U416.4(VCC) U417.4(VCC) U418.4(VCC)
GND: C400.1 C401.1 C402.1 C403.1 C404.1 C405.1 C406.1 C407.1 C408.1 C409.1 C410.1 C411.1 C412.1 C413.1 C414.1 C415.1 C416.1 C417.1 C418.1 U400.3(GND) U401.3(GND) U402.3(GND) U403.3(GND) U404.3(GND) U405.3(GND) U406.3(GND) U407.3(GND) U408.3(GND) U409.3(GND) U410.3(GND) U411.3(GND) U412.3(GND) U413.3(GND) U414.3(GND) U415.3(GND) U416.3(GND) U417.3(GND) U418.3(GND)
CO1: U400.5(CO) U401.2(CIN)
CO2: U401.5(CO) U402.2(CIN)
CO3: U402.5(CO) U403.2(CIN)
CO4: U403.5(CO) U404.2(CIN)
CO5: U404.5(CO) U405.2(CIN)
CO6: U405.5(CO) U406.2(CIN)
CO7: U406.5(CO) U407.2(CIN)
CO8: U407.5(CO) U408.2(CIN)
CO9: U408.5(CO) U409.2(CIN)
CO10: U409.5(CO) U410.2(CIN)
CO11: U410.5(CO) U411.2(CIN)
CO13: U411.5(CO) U412.2(CIN)
CO14: U412.5(CO) U413.2(CIN)
CO15: U413.5(CO) U414.2(CIN)
CO16: U414.5(CO) U415.2(CIN)
CO17: U415.5(CO) U416.2(CIN)
CO18: U416.5(CO) U417.2(CIN)
CO19: U417.5(CO) U418.2(CIN)
CO20: U418.5(CO) ; off-sheet CO20
CO50: U400.2(CIN) ; off-sheet CO50
DO1: U400.6(DO) U401.1(DI)
DO2: U401.6(DO) U402.1(DI)
DO3: U402.6(DO) U403.1(DI)
DO4: U403.6(DO) U404.1(DI)
DO5: U404.6(DO) U405.1(DI)
DO6: U405.6(DO) U406.1(DI)
DO7: U406.6(DO) U407.1(DI)
DO8: U407.6(DO) U408.1(DI)
DO9: U408.6(DO) U409.1(DI)
DO10: U409.6(DO) U410.1(DI)
DO11: U410.6(DO) U411.1(DI)
DO13: U411.6(DO) U412.1(DI)
DO14: U412.6(DO) U413.1(DI)
DO15: U413.6(DO) U414.1(DI)
DO16: U414.6(DO) U415.1(DI)
DO17: U415.6(DO) U416.1(DI)
DO18: U416.6(DO) U417.1(DI)
DO19: U417.6(DO) U418.1(DI)
DO20: U418.6(DO) ; off-sheet DO20
DO50: U400.1(DI) ; off-sheet DO50

### Notes on the sheet
- LEDs
- Title:
- Size:
- A
- Machine:
- P.C. Board No:
- Assembly No:
- Rev:
- Sheet:
- of
- College of Engineering
- 1415 Engineering Drive
- Madison, WI 53706

### Library data of the parts
C400-C418 = CAP_0805_U_010.00: CAP CER 10UF 16V X7R 0805; Manufacturer: Samsung; Manufacturer Part Number: CL21A106KPCLQNC; Tolerance: 10%; Voltage Rating: 10V; Dielectric: X5R; ComponentLink3URL: https://datasheet.ciiva.com/26920/getdatasheetpartid-355170-26920201.pdf; ComponentLink3Description: https://datasheet.ciiva.com/26920/getdatasheetpartid-355170-26920201.pdf; Supplier 1: Digi-Key; Stock 1: 40000; Pricing 1: 1=0.22, 10=0.148, 100=0.0749, 500=0.05122, 1000=0.04531 (USD); Mount: Surface Mount; Case/Package: 0805; Case Code (Metric): 2012; Case Code (Imperial): 0805; Contact Plating: Tin; Min Operating Temperature: -55°C; Max Operating Temperature: 85°C; Packaging: Tape and Reel; Package Quantity: 1; Length: 2mm; Height: 0.85mm; Width: 0.049inch; Thickness: 0.037inch; Depth: 1.25mm; Radiation Hardening: No; ComponentLink1URL: https://datasheet.ciiva.com/25730/cl21a106kpclqnc-25730594.pdf; ComponentLink1Description: https://datasheet.ciiva.com/25730/cl21a106kpclqnc-25730594.pdf; Supplier Part Number 1: 1276-2402-1-ND; Capacitance: 10uF
U400-U418 = IC_APA102C: APA102C LED

## Sheet 05_LEDs.SchDoc: ECE315 Analog
size A; Date: 4/25/2017; ApprovedBy: JSK; CheckedBy: JSK; Author: JSK; CompanyName: University of Wisconsin; DrawnBy: JSK; Engineer: JSK; Organization: ECE 315; Address1: College of Engineering; Address2: 1415 Engineering Drive; Address3: Madison, WI 53706; Address4: ECE 315 Fall 2017; Revision: A; SheetNumber: 2; SheetTotal: 2; AssemblyNumber: 0; MachineName: ECE315-S19; PCBNumber: 001; ApprovedDate: 1/17/2019
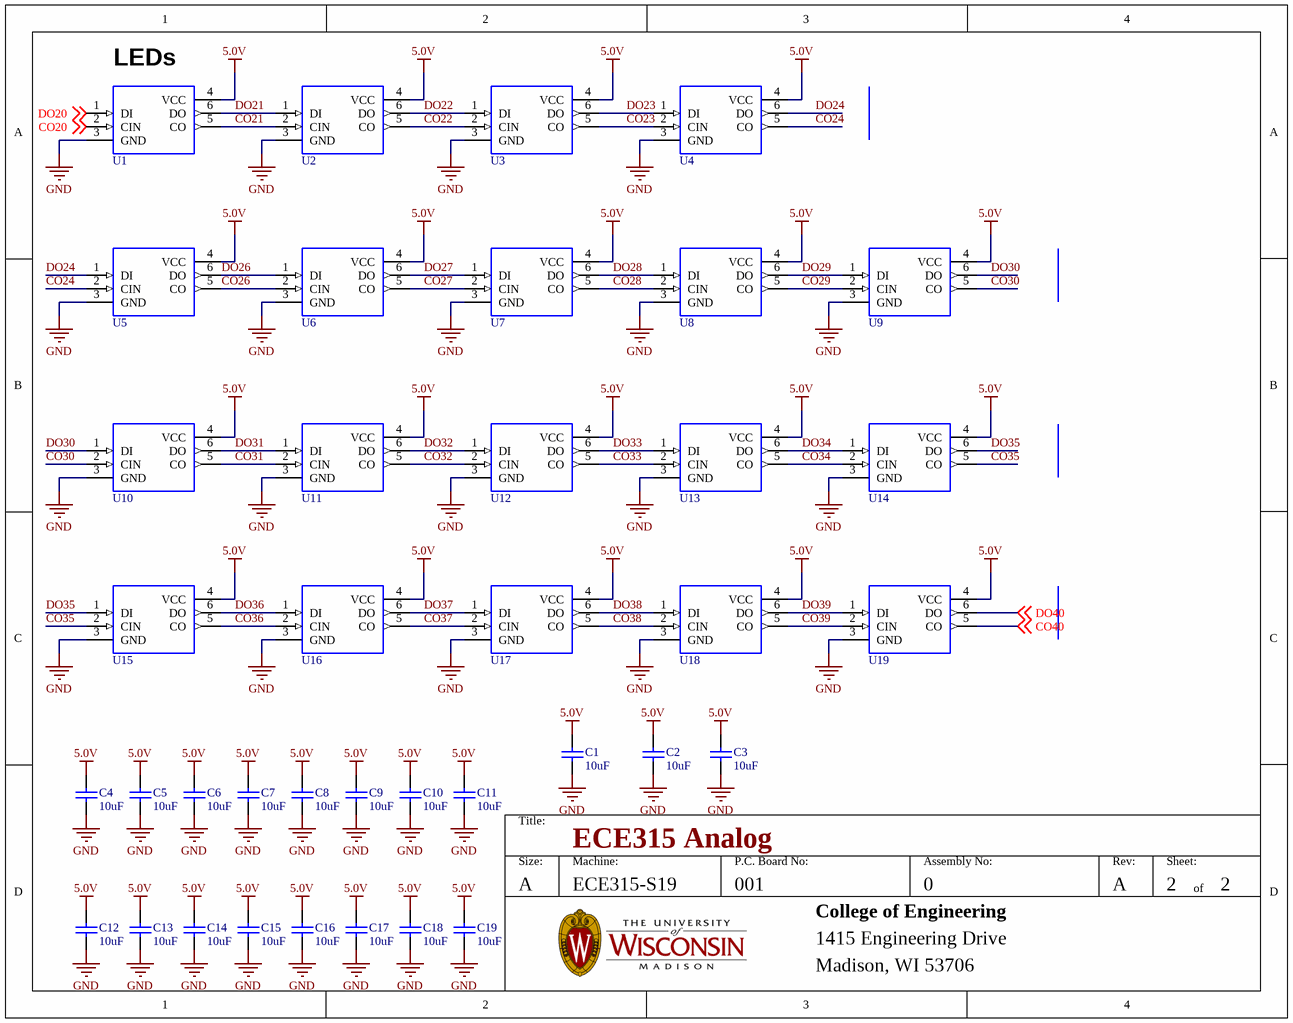
[diagram p4: 05_LEDs.SchDoc]

### Parts
C1  10uF  [CAP_0805]
C2  10uF  [CAP_0805]
C3  10uF  [CAP_0805]
C4  10uF  [CAP_0805]
C5  10uF  [CAP_0805]
C6  10uF  [CAP_0805]
C7  10uF  [CAP_0805]
C8  10uF  [CAP_0805]
C9  10uF  [CAP_0805]
C10  10uF  [CAP_0805]
C11  10uF  [CAP_0805]
C12  10uF  [CAP_0805]
C13  10uF  [CAP_0805]
C14  10uF  [CAP_0805]
C15  10uF  [CAP_0805]
C16  10uF  [CAP_0805]
C17  10uF  [CAP_0805]
C18  10uF  [CAP_0805]
C19  10uF  [CAP_0805]
U1  IC_APA102C  [APA102C]  (value not drawn)
U2  IC_APA102C  [APA102C]  (value not drawn)
U3  IC_APA102C  [APA102C]  (value not drawn)
U4  IC_APA102C  [APA102C]  (value not drawn)
U5  IC_APA102C  [APA102C]  (value not drawn)
U6  IC_APA102C  [APA102C]  (value not drawn)
U7  IC_APA102C  [APA102C]  (value not drawn)
U8  IC_APA102C  [APA102C]  (value not drawn)
U9  IC_APA102C  [APA102C]  (value not drawn)
U10  IC_APA102C  [APA102C]  (value not drawn)
U11  IC_APA102C  [APA102C]  (value not drawn)
U12  IC_APA102C  [APA102C]  (value not drawn)
U13  IC_APA102C  [APA102C]  (value not drawn)
U14  IC_APA102C  [APA102C]  (value not drawn)
U15  IC_APA102C  [APA102C]  (value not drawn)
U16  IC_APA102C  [APA102C]  (value not drawn)
U17  IC_APA102C  [APA102C]  (value not drawn)
U18  IC_APA102C  [APA102C]  (value not drawn)
U19  IC_APA102C  [APA102C]  (value not drawn)

### Nets
5.0V: C1.2 C2.2 C3.2 C4.2 C5.2 C6.2 C7.2 C8.2 C9.2 C10.2 C11.2 C12.2 C13.2 C14.2 C15.2 C16.2 C17.2 C18.2 C19.2 U1.4(VCC) U2.4(VCC) U3.4(VCC) U4.4(VCC) U5.4(VCC) U6.4(VCC) U7.4(VCC) U8.4(VCC) U9.4(VCC) U10.4(VCC) U11.4(VCC) U12.4(VCC) U13.4(VCC) U14.4(VCC) U15.4(VCC) U16.4(VCC) U17.4(VCC) U18.4(VCC) U19.4(VCC)
GND: C1.1 C2.1 C3.1 C4.1 C5.1 C6.1 C7.1 C8.1 C9.1 C10.1 C11.1 C12.1 C13.1 C14.1 C15.1 C16.1 C17.1 C18.1 C19.1 U1.3(GND) U2.3(GND) U3.3(GND) U4.3(GND) U5.3(GND) U6.3(GND) U7.3(GND) U8.3(GND) U9.3(GND) U10.3(GND) U11.3(GND) U12.3(GND) U13.3(GND) U14.3(GND) U15.3(GND) U16.3(GND) U17.3(GND) U18.3(GND) U19.3(GND)
CO20: U1.2(CIN) ; off-sheet CO20
CO21: U1.5(CO) U2.2(CIN)
CO22: U2.5(CO) U3.2(CIN)
CO23: U3.5(CO) U4.2(CIN)
CO24: U4.5(CO) U5.2(CIN)
CO26: U5.5(CO) U6.2(CIN)
CO27: U6.5(CO) U7.2(CIN)
CO28: U7.5(CO) U8.2(CIN)
CO29: U8.5(CO) U9.2(CIN)
CO30: U9.5(CO) U10.2(CIN)
CO31: U10.5(CO) U11.2(CIN)
CO32: U11.5(CO) U12.2(CIN)
CO33: U12.5(CO) U13.2(CIN)
CO34: U13.5(CO) U14.2(CIN)
CO35: U14.5(CO) U15.2(CIN)
CO36: U15.5(CO) U16.2(CIN)
CO37: U16.5(CO) U17.2(CIN)
CO38: U17.5(CO) U18.2(CIN)
CO39: U18.5(CO) U19.2(CIN)
CO40: U19.5(CO) ; off-sheet CO40
DO20: U1.1(DI) ; off-sheet DO20
DO21: U1.6(DO) U2.1(DI)
DO22: U2.6(DO) U3.1(DI)
DO23: U3.6(DO) U4.1(DI)
DO24: U4.6(DO) U5.1(DI)
DO26: U5.6(DO) U6.1(DI)
DO27: U6.6(DO) U7.1(DI)
DO28: U7.6(DO) U8.1(DI)
DO29: U8.6(DO) U9.1(DI)
DO30: U9.6(DO) U10.1(DI)
DO31: U10.6(DO) U11.1(DI)
DO32: U11.6(DO) U12.1(DI)
DO33: U12.6(DO) U13.1(DI)
DO34: U13.6(DO) U14.1(DI)
DO35: U14.6(DO) U15.1(DI)
DO36: U15.6(DO) U16.1(DI)
DO37: U16.6(DO) U17.1(DI)
DO38: U17.6(DO) U18.1(DI)
DO39: U18.6(DO) U19.1(DI)
DO40: U19.6(DO) ; off-sheet DO40

### Notes on the sheet
- (near U1) LEDs
- Title:
- Size:
- A
- Machine:
- P.C. Board No:
- Assembly No:
- Rev:
- Sheet:
- of
- College of Engineering
- 1415 Engineering Drive
- Madison, WI 53706

### Library data of the parts
C1-C19 = CAP_0805_U_010.00: as C400 on sheet 04_LEDs; ComponentLink3URL: https://datasheet.ciiva.com/26920/getdatasheetpartid-355170-26920201.pdf; ComponentLink3Description: https://datasheet.ciiva.com/26920/getdatasheetpartid-355170-26920201.pdf; Supplier 1: Digi-Key; Stock 1: 40000; Pricing 1: 1=0.22, 10=0.148, 100=0.0749, 500=0.05122, 1000=0.04531 (USD); Mount: Surface Mount; Case/Package: 0805; Case Code (Metric): 2012; Case Code (Imperial): 0805; Contact Plating: Tin; Min Operating Temperature: -55°C; Max Operating Temperature: 85°C; Packaging: Tape and Reel; Package Quantity: 1; Length: 2mm; Height: 0.85mm; Width: 0.049inch; Thickness: 0.037inch; Depth: 1.25mm; Radiation Hardening: No; ComponentLink1URL: https://datasheet.ciiva.com/25730/cl21a106kpclqnc-25730594.pdf; ComponentLink1Description: https://datasheet.ciiva.com/25730/cl21a106kpclqnc-25730594.pdf; Supplier Part Number 1: 1276-2402-1-ND; Capacitance: 10uF
U1-U19 = IC_APA102C: APA102C LED

## Sheet 06_LEDs.SchDoc: ECE315 Analog
size A; Date: 4/25/2017; ApprovedBy: JSK; CheckedBy: JSK; Author: JSK; CompanyName: University of Wisconsin; DrawnBy: JSK; Engineer: JSK; Organization: ECE 315; Address1: College of Engineering; Address2: 1415 Engineering Drive; Address3: Madison, WI 53706; Address4: ECE 315 Fall 2017; Revision: A; SheetNumber: 2; SheetTotal: 2; AssemblyNumber: 0; MachineName: ECE315-S19; PCBNumber: 001; ApprovedDate: 1/17/2019
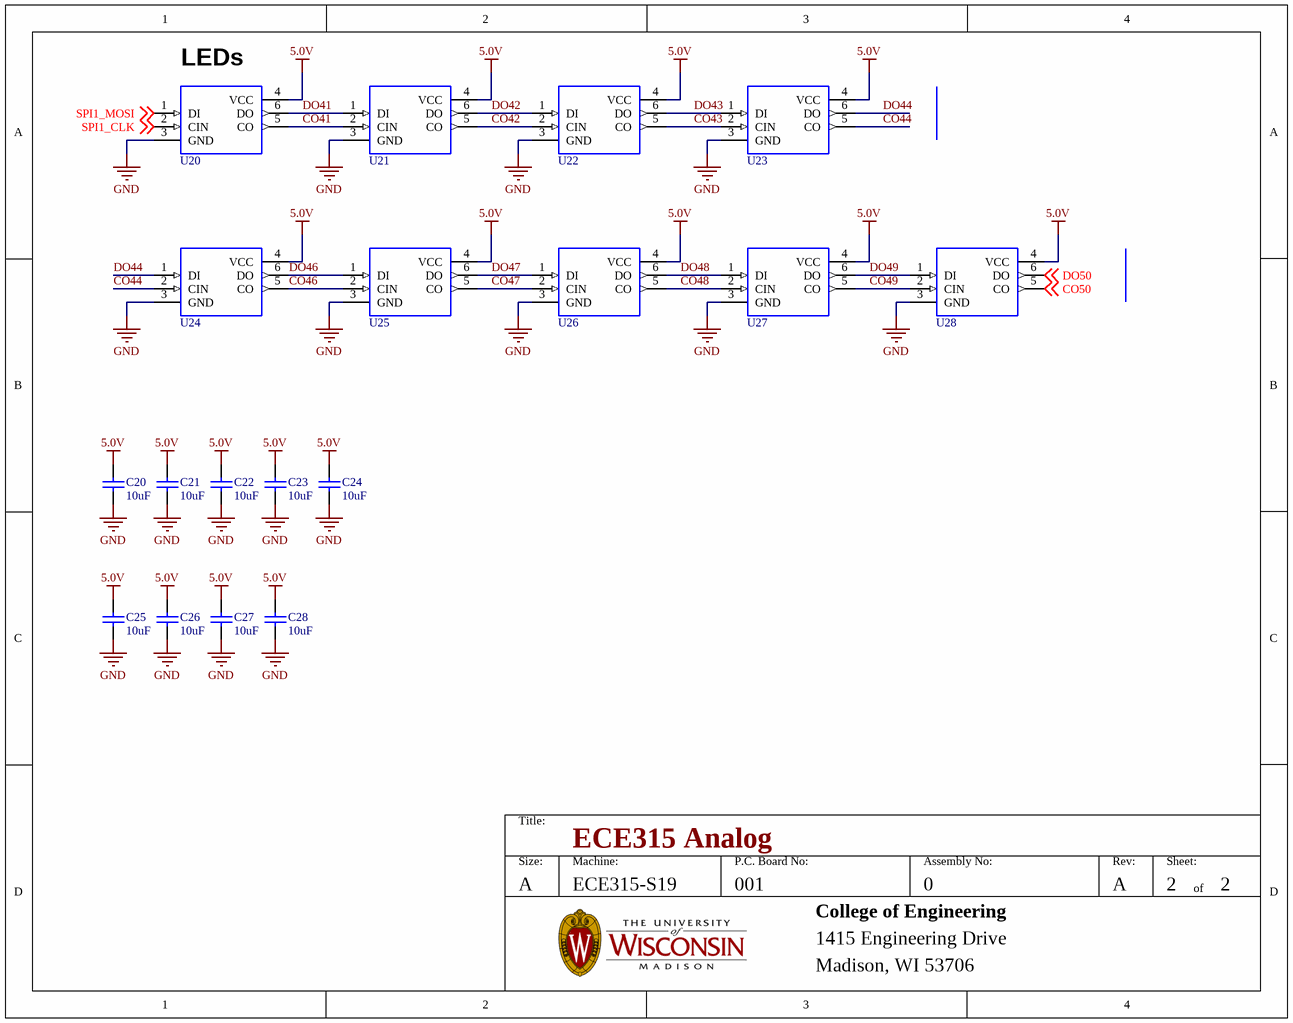
[diagram p5: 06_LEDs.SchDoc]

### Parts
C20  10uF  [CAP_0805]
C21  10uF  [CAP_0805]
C22  10uF  [CAP_0805]
C23  10uF  [CAP_0805]
C24  10uF  [CAP_0805]
C25  10uF  [CAP_0805]
C26  10uF  [CAP_0805]
C27  10uF  [CAP_0805]
C28  10uF  [CAP_0805]
U20  IC_APA102C  [APA102C]  (value not drawn)
U21  IC_APA102C  [APA102C]  (value not drawn)
U22  IC_APA102C  [APA102C]  (value not drawn)
U23  IC_APA102C  [APA102C]  (value not drawn)
U24  IC_APA102C  [APA102C]  (value not drawn)
U25  IC_APA102C  [APA102C]  (value not drawn)
U26  IC_APA102C  [APA102C]  (value not drawn)
U27  IC_APA102C  [APA102C]  (value not drawn)
U28  IC_APA102C  [APA102C]  (value not drawn)

### Nets
5.0V: C20.2 C21.2 C22.2 C23.2 C24.2 C25.2 C26.2 C27.2 C28.2 U20.4(VCC) U21.4(VCC) U22.4(VCC) U23.4(VCC) U24.4(VCC) U25.4(VCC) U26.4(VCC) U27.4(VCC) U28.4(VCC)
GND: C20.1 C21.1 C22.1 C23.1 C24.1 C25.1 C26.1 C27.1 C28.1 U20.3(GND) U21.3(GND) U22.3(GND) U23.3(GND) U24.3(GND) U25.3(GND) U26.3(GND) U27.3(GND) U28.3(GND)
CO41: U20.5(CO) U21.2(CIN)
CO42: U21.5(CO) U22.2(CIN)
CO43: U22.5(CO) U23.2(CIN)
CO44: U23.5(CO) U24.2(CIN)
CO46: U24.5(CO) U25.2(CIN)
CO47: U25.5(CO) U26.2(CIN)
CO48: U26.5(CO) U27.2(CIN)
CO49: U27.5(CO) U28.2(CIN)
CO50: U28.5(CO) ; off-sheet CO50
DO41: U20.6(DO) U21.1(DI)
DO42: U21.6(DO) U22.1(DI)
DO43: U22.6(DO) U23.1(DI)
DO44: U23.6(DO) U24.1(DI)
DO46: U24.6(DO) U25.1(DI)
DO47: U25.6(DO) U26.1(DI)
DO48: U26.6(DO) U27.1(DI)
DO49: U27.6(DO) U28.1(DI)
DO50: U28.6(DO) ; off-sheet DO50
SPI1_CLK: U20.2(CIN) ; off-sheet SPI1_CLK
SPI1_MOSI: U20.1(DI) ; off-sheet SPI1_MOSI

### Notes on the sheet
- (near U20) LEDs
- Title:
- Size:
- A
- Machine:
- P.C. Board No:
- Assembly No:
- Rev:
- Sheet:
- of
- College of Engineering
- 1415 Engineering Drive
- Madison, WI 53706

### Library data of the parts
C20-C28 = CAP_0805_U_010.00: as C400 on sheet 04_LEDs; ComponentLink3URL: https://datasheet.ciiva.com/26920/getdatasheetpartid-355170-26920201.pdf; ComponentLink3Description: https://datasheet.ciiva.com/26920/getdatasheetpartid-355170-26920201.pdf; Supplier 1: Digi-Key; Stock 1: 40000; Pricing 1: 1=0.22, 10=0.148, 100=0.0749, 500=0.05122, 1000=0.04531 (USD); Mount: Surface Mount; Case/Package: 0805; Case Code (Metric): 2012; Case Code (Imperial): 0805; Contact Plating: Tin; Min Operating Temperature: -55°C; Max Operating Temperature: 85°C; Packaging: Tape and Reel; Package Quantity: 1; Length: 2mm; Height: 0.85mm; Width: 0.049inch; Thickness: 0.037inch; Depth: 1.25mm; Radiation Hardening: No; ComponentLink1URL: https://datasheet.ciiva.com/25730/cl21a106kpclqnc-25730594.pdf; ComponentLink1Description: https://datasheet.ciiva.com/25730/cl21a106kpclqnc-25730594.pdf; Supplier Part Number 1: 1276-2402-1-ND; Capacitance: 10uF
U20-U28 = IC_APA102C: APA102C LED

## Sheet 07_Buzzer.SchDoc: ECE315 Analog
size A; Date: 4/25/2017; ApprovedBy: JSK; CheckedBy: JSK; Author: JSK; CompanyName: University of Wisconsin; DrawnBy: JSK; Engineer: JSK; Organization: ECE 315; Address1: College of Engineering; Address2: 1415 Engineering Drive; Address3: Madison, WI 53706; Address4: ECE 315 Fall 2017; Revision: A; SheetNumber: 2; SheetTotal: 2; AssemblyNumber: 0; MachineName: ECE315-S19; PCBNumber: 001; ApprovedDate: 1/17/2019
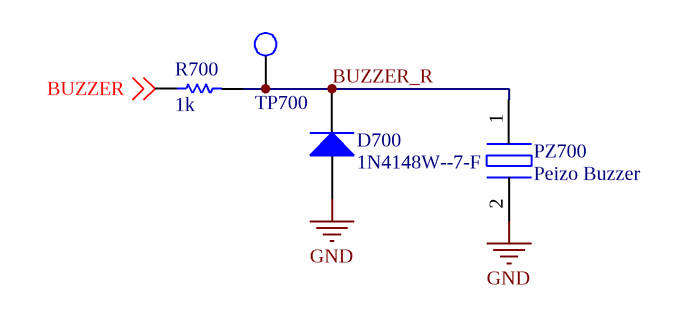
[diagram p6: 07_Buzzer.SchDoc]

### Parts
D700  Manufacturer Part Number: 1N4148W--7-F  [SOD323-12]  (hidden comment: DIODE_4148)
PZ700  Peizo Buzzer  [PKLCS]
R700  Resistance (Ohms): 1k  [RES_0805]  (hidden comment: RES_0805_K_001.00)
TP700  TP_1206  [TP-SMC-1206]  (value not drawn)

### Nets
GND: D700.2(A) PZ700.2(In)
BUZZER: R700.1 ; off-sheet BUZZER
BUZZER_R: D700.1(K) PZ700.1(In) R700.2 TP700.1

### Notes on the sheet
- Title:
- Size:
- A
- Machine:
- P.C. Board No:
- Assembly No:
- Rev:
- Sheet:
- of
- College of Engineering
- 1415 Engineering Drive
- Madison, WI 53706

### Library data of the parts
D700 = DIODE_4148: DIODE GEN PURP 100V 300MA SOD123; Manufacturer: Diodes; Diode Configuration: Single; Number of Elements per Chip: 1; Maximum Forward Voltage: 1.25V; Supplier 1: Digi-Key; Stock 1: 993734; Pricing 1: 1=0.18, 10=0.164, 100=0.0891, 500=0.0548, 1000=0.0374 (USD); Mounting Type: Surface Mount; Maximum Reverse Voltage: 100V; Package Type: SOD-123; Pin Count: 2; ComponentLink1URL: http://uk.rs-online.com/webdocs/0f8c/0900766b80f8c94e.pdf; ComponentLink1Description: http://uk.rs-online.com/webdocs/0f8c/0900766b80f8c94e.pdf; Supplier Part Number 1: 1N4148W-FDICT-ND
PZ700 = Peizo: AUDIO PIEZO TRANSDUCER 12.5V SMD; Manufacturer Part Number: PKLCS1212E2000-R1; Manufacturer: Murata Electronics North America; Voltage Range: 12.5V (Max); Sound Pressure Level: 70dB @ 1.5V, 10cm; Input Type: Zero-Peak Signal; Voltage - Rated: 1.5V; Driver Circuitry: Transducer, Externally Driven; Port Location: Side; Frequency: 2kHz; Operating Mode: Single Tone; Supplier: Digi-Key; RoHS: RoHS Compliant; Mounting Type: Surface Mount; Category: Audio Products; Termination: Solder Pads; Operating Temperature: -20°C ~ 70°C; Size / Dimension: 12.0mm L x 12.0mm W x 3.0mm H; Packaging: Cut Tape (CT); Technology: Piezo; Supplier Part Number: 490-5260-1-ND
R700 = RES_0805_K_001.00: RES SMD 1K OHM 1% 1/8W 0805; Manufacturer Part Number: ERJ-6ENF1001V; Manufacturer: Panasonic Electronic Components; Temperature Coefficient: ±100ppm/°C; Power (Watts): 0.125W, 1/8W; Failure Rate: -; Category: Resistors; Operating Temperature: -55°C ~ 155°C; RoHS: RoHS Compliant; Height - Seated (Max): 0.028" (0.70mm); Package / Case: 0805 (2012 Metric); Part Status: Active; Supplier: Digi-Key; Size / Dimension: 0.079" L x 0.049" W (2.00mm x 1.25mm); Composition: Thick Film; Features: Automotive AEC-Q200; Number of Terminations: 2; Tolerance: ±1%; Packaging: Cut Tape (CT); Supplier Device Package: 0805; Supplier Part Number: P1.00KCCT-ND
TP700 = TP_1206: as TP200 on sheet 02-Power; Supplier 1: Digi-Key; Supplier Part Number 1: A106143CT-ND; Stock 1: 31937; Pricing 1: 1=0.28, 10=0.261, 25=0.224, 50=0.1902, 100=0.1828, 250=0.1641, 500=0.1567, 1000=0.1306 (USD); Case Size: 1206; Dimension: 3.2 x 1.6 x 1.25mm; Family: RC; Mounting: Surface Mount; Operating Temperature: -55 to 125 C; Part No: 1625854-1; RoHS: Yes; Packaging: Tape and Reel; Termination Style: N/R; Terminal Pitch: N/R; Power Rating: N/R; Tolerance: N/R; ComponentLink1URL: https://datasheet.ciiva.com/6439/eng-ds-1773266-a-6439169.pdf; ComponentLink1Description: https://datasheet.ciiva.com/6439/eng-ds-1773266-a-6439169.pdf; ComponentLink2URL: https://datasheet.ciiva.com/30136/1773266-a-30136341.pdf; ComponentLink2Description: https://datasheet.ciiva.com/30136/1773266-a-30136341.pdf; ComponentLink3URL: https://datasheet.ciiva.com/6439/eng-ds-1773266-a-6439080.pdf; ComponentLink3Description: https://datasheet.ciiva.com/6439/eng-ds-1773266-a-6439080.pdf; ComponentLink4URL: https://datasheet.ciiva.com/6439/eng-ds-1773266-a-6439081.pdf; ComponentLink4Description: https://datasheet.ciiva.com/6439/eng-ds-1773266-a-6439081.pdf; ComponentLink5URL: https://datasheet.ciiva.com/6439/eng-ds-1773266-a-6439083.pdf; ComponentLink5Description: https://datasheet.ciiva.com/6439/eng-ds-1773266-a-6439083.pdf